# EasyEDA schematic SCH_555-Circuit_2024-04-23.json
TITLE: Sheet_1; REV: 1.0; Date: 2024-04-22; Sheet: 1/1; Drawn By: perneetb; Company: Your Company
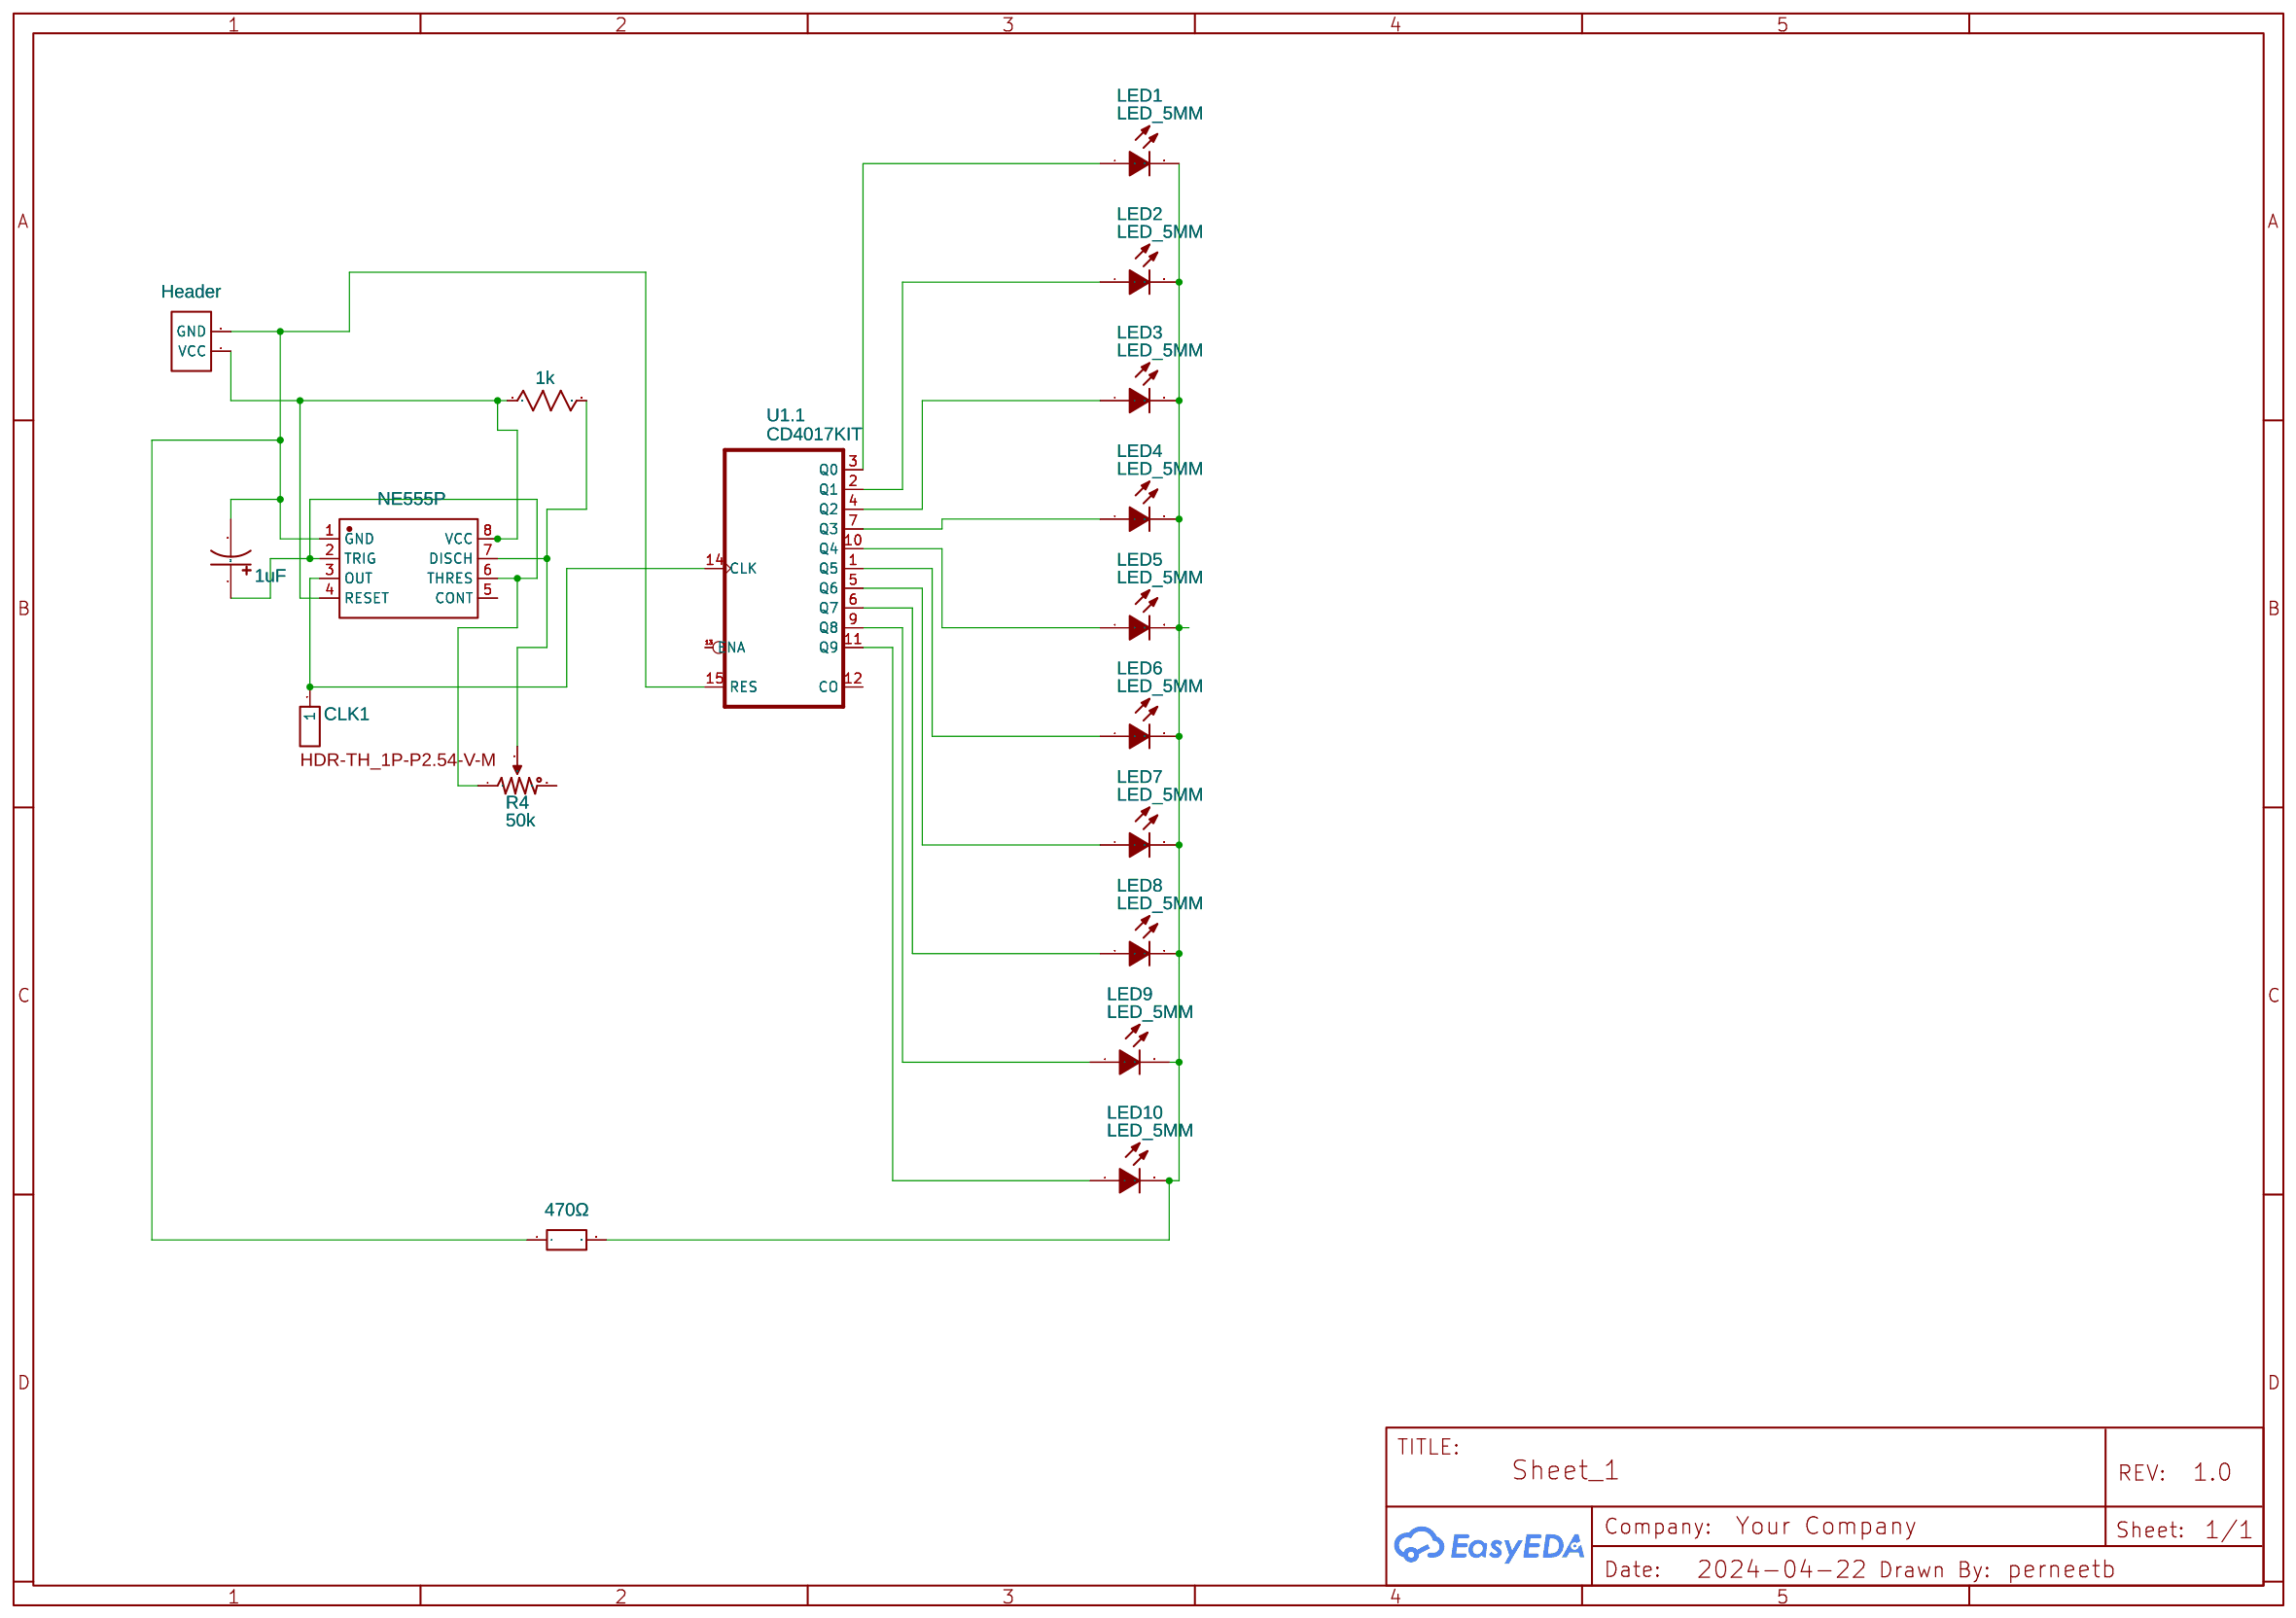
[diagram p0: schematic sheet]

## Parts
C1  1uF  [CAP-TH_BD5.0-P2.00-D0.8-FD]
CLK1  C81276  [HDR-TH_1P-P2.54-V-M]
H1  Header  [HEADER-FEMALE-2.54_1X2]
LED1  LED_5MM  [LED-TH_BD5.0-P2.54-FD_C9900023552]
LED2  LED_5MM  [LED-TH_BD5.0-P2.54-FD_C9900023552]
LED3  LED_5MM  [LED-TH_BD5.0-P2.54-FD_C9900023552]
LED4  LED_5MM  [LED-TH_BD5.0-P2.54-FD_C9900023552]
LED5  LED_5MM  [LED-TH_BD5.0-P2.54-FD_C9900023552]
LED6  LED_5MM  [LED-TH_BD5.0-P2.54-FD_C9900023552]
LED7  LED_5MM  [LED-TH_BD5.0-P2.54-FD_C9900023552]
LED8  LED_5MM  [LED-TH_BD5.0-P2.54-FD_C9900023552]
LED9  LED_5MM  [LED-TH_BD5.0-P2.54-FD_C9900023552]
LED10  LED_5MM  [LED-TH_BD5.0-P2.54-FD_C9900023552]
R2  1k  [AXIAL-0.3]
R4  50k  [RES-ADJ_3296X]
U1  CD4017KIT  [DIL16-KIT]  (section 1)
U2  470Ω  [RES-TH_BD3.3-L9.0-P13.00-D0.6]
U3  NE555P  [DIP-8_L9.8-W6.6-P2.54-LS7.6-BL]

## Library data of the parts
C1 = UVZ1H010MDD: Contributor: LCSC; Supplier: LCSC; Supplier Part: C62934; Manufacturer: Nichicon(尼吉康)
CLK1 = Header-Male-2.54_1x1: Supplier: LCSC; Manufacturer Part: 2.54-1*1P针; JLCPCB Part Class: Extended Part; Package Display: Yes; Manufacturer: BOOMELE(Boom Precision Elec); Contributor: Thejo Prakash
H1 = HEADER-FEMALE-2.54_1X2: Contributor: nonstop2004; Supplier Part: C492401; Supplier: LCSC
LED1-LED10 = LED_5MM: Contributor: lcsc; Supplier: LCSC; Supplier Part: C2992663; Manufacturer: null; JLCPCB Part Class: Extended Part
R2 = Resistor: Manufacturer Part: ?; Supplier: LCSC; Supplier Part: C713997
R4 = Potentiometer: K(%): 50; Manufacturer Part: ?; Supplier Part: C118912; Supplier: LCSC
U1 = CD4017KIT: Contributor: SparkFun; subpart_no: 1; Supplier: LCSC; Supplier Part: C34519
U2 = RSF-50JT-52-470R: Contributor: lcsc; Supplier: LCSC; Supplier Part: C1377653; Manufacturer: YAGEO(国巨)
U3 = NE555P: Supplier: LCSC; Manufacturer: TI(德州仪器); Supplier Part: C46749; JLCPCB Part Class: Extended Part

## Nets
Net-(C1-1): C1.1 R4.1 U3.2(TRIG) U3.6(THRES)
Net-(C1-2): C1.2 H1.2(GND) U1.15(RES) U2.1 U3.1(GND)
Net-(CLK1-1): CLK1.1 U1.14(CLK) U3.3(OUT)
Net-(H1-1): H1.1(VCC) R2.1 U3.4(RESET) U3.8(VCC)
Net-(LED1-1): LED1.1(A) U1.3(Q0)
Net-(LED1-2): LED1.2(K) LED2.2(K) LED3.2(K) LED4.2(K) LED5.2(K) LED6.2(K) LED7.2(K) LED8.2(K) LED9.2(K) LED10.2(K) U2.2
Net-(LED2-1): LED2.1(A) U1.2(Q1)
Net-(LED3-1): LED3.1(A) U1.4(Q2)
Net-(LED4-1): LED4.1(A) U1.7(Q3)
Net-(LED5-1): LED5.1(A) U1.10(Q4)
Net-(LED6-1): LED6.1(A) U1.1(Q5)
Net-(LED7-1): LED7.1(A) U1.5(Q6)
Net-(LED8-1): LED8.1(A) U1.6(Q7)
Net-(LED9-1): LED9.1(A) U1.9(Q8)
Net-(LED10-1): LED10.1(A) U1.11(Q9)
Net-(R2-2): R2.2 R4.2(3) U3.7(DISCH)

Not connected (* = marked no-connect by the designer): R4 3(2); U1 12(CO) 13(ENA); U3 5(CONT)
